# Altium schematic sheet AFE_MCU.SchDoc
size A3; _Date0: 31st Dec 2016; _Designer: Joshua Smith; _Drn0: ABC; _ECN0: N/A; _ISS0: A0; _Notes0: First Issue; _Project: Project; _SchematicNumber: SchematicNumber; _Sheet: 1 of 1; _Title: Title; SheetTitle: **; CompanyName: Microchip Technology Inc.; Organization: Microchip Technology; Address1: 2355 West Chandler Blvd.; Address2: Chandler, AZ  85224; Address4: USA; SheetNumber: 1; SheetTotal: 4; Time: Time
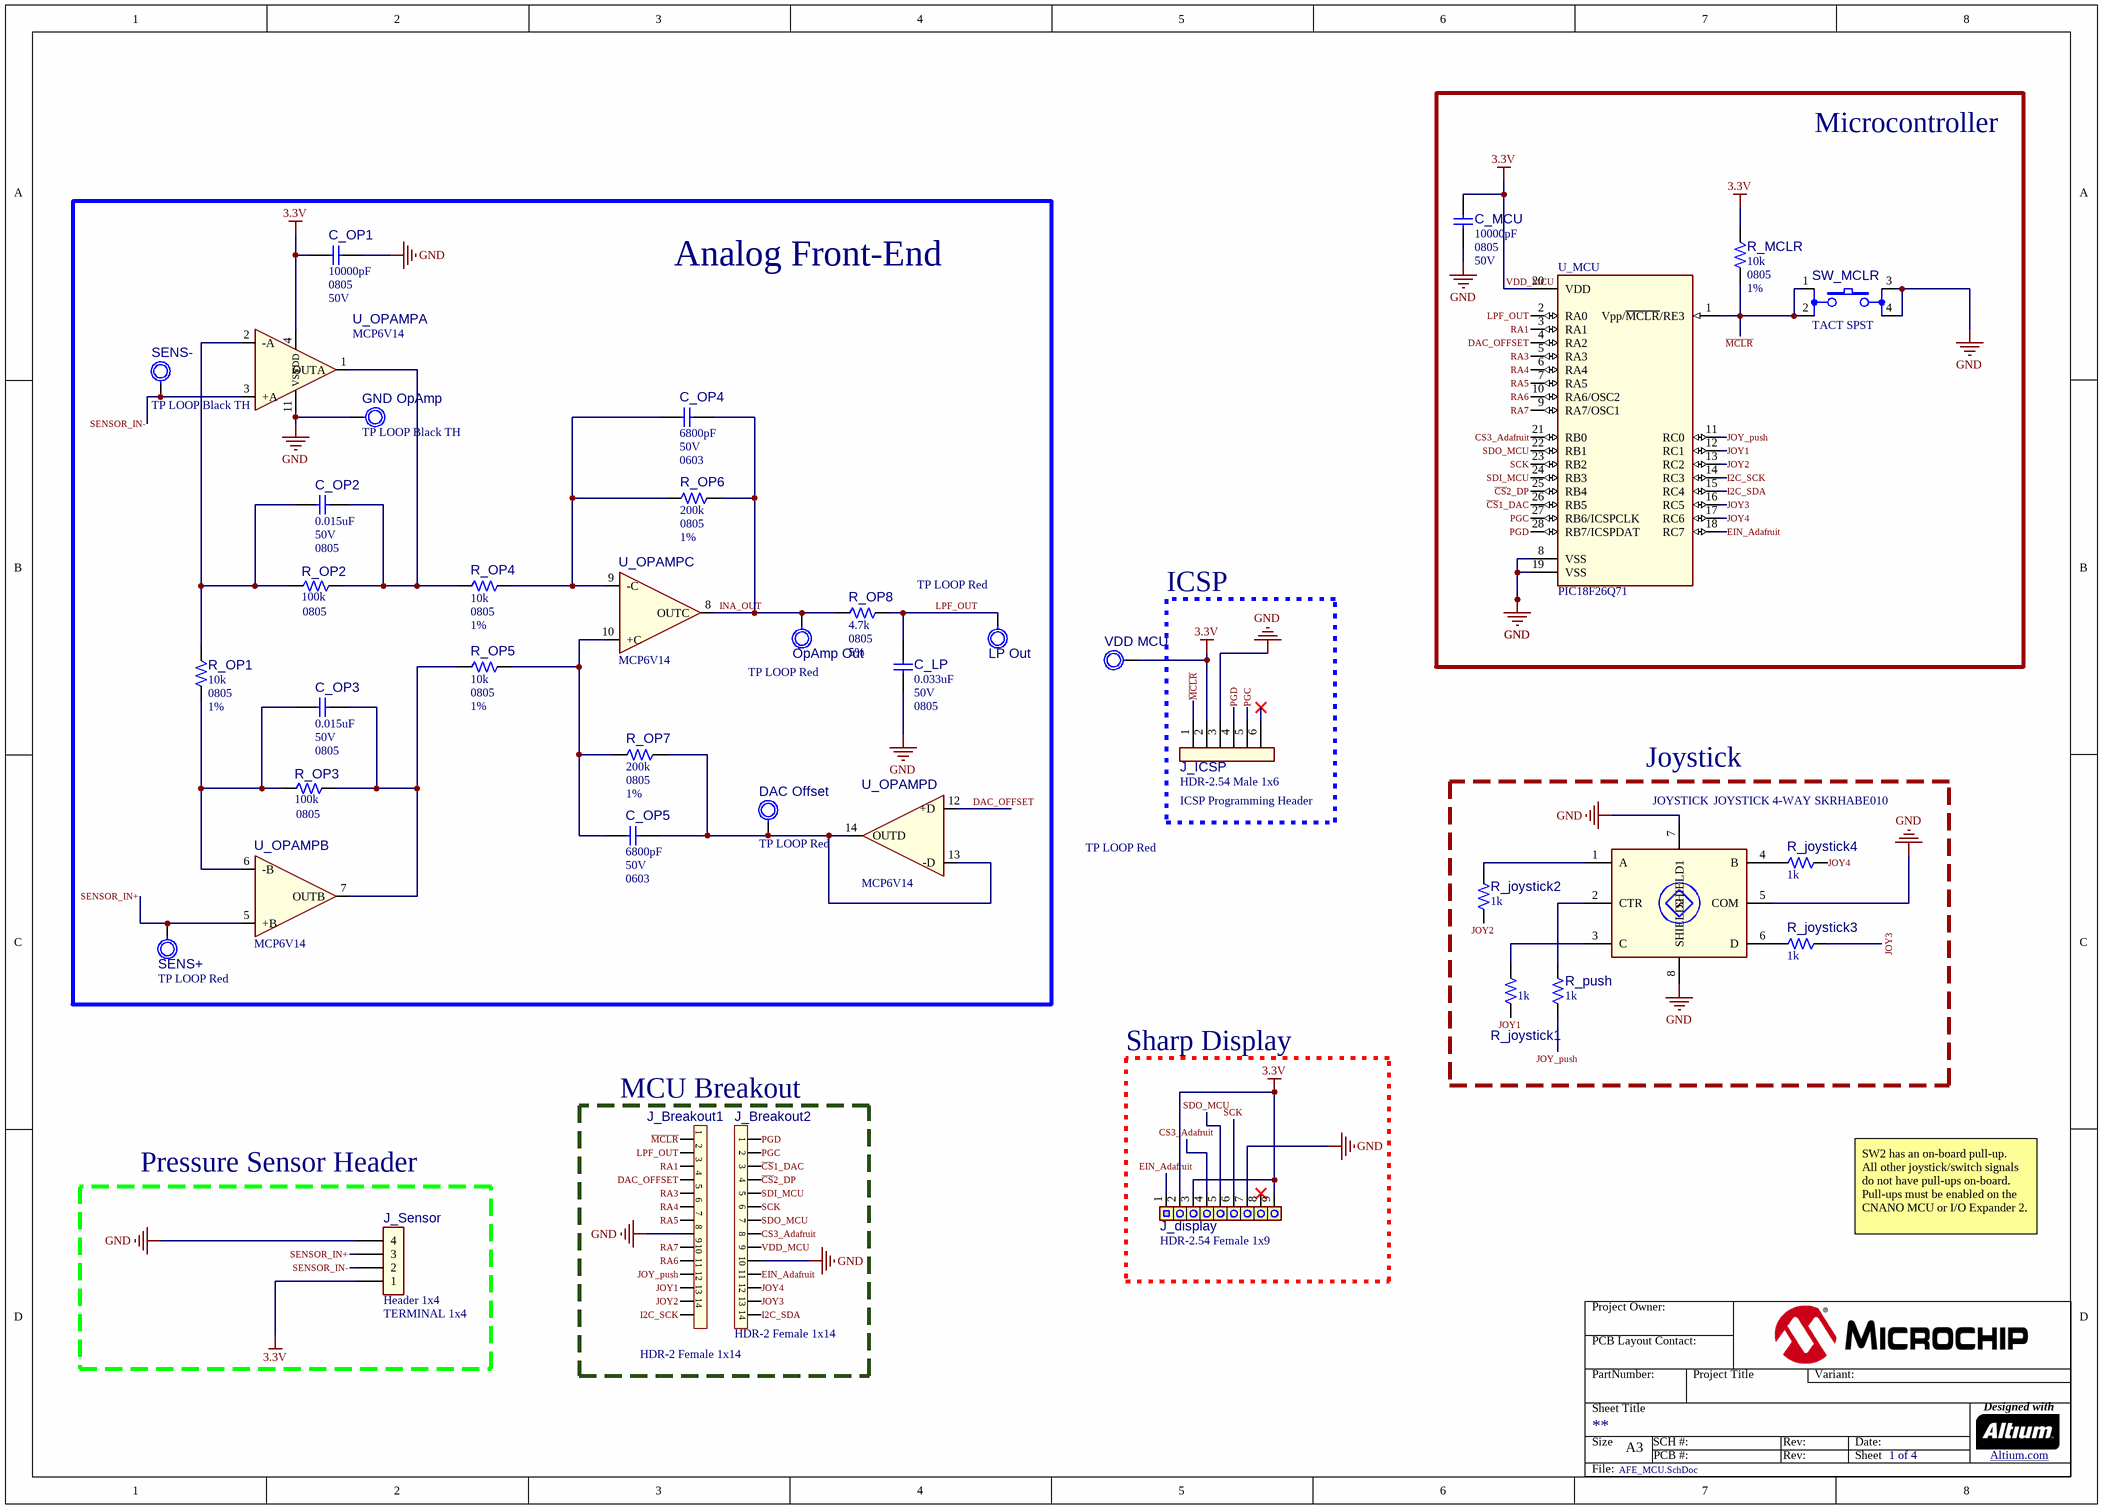
[diagram p0: AFE_MCU.SchDoc]

## Parts
C_LP  value 0.033uF  Voltage: 50V  Package: 0805  [CAP_C_0805]  (hidden comment: Capacitor NP)
C_MCU  value 10000pF  Package: 0805  Voltage: 50V  [CAP_C_0805]  (hidden comment: Capacitor NP)
C_OP1  value 10000pF  Package: 0805  Voltage: 50V  [CAP_C_0805]  (hidden comment: Capacitor NP)
C_OP2  value 0.015uF  Voltage: 50V  Package: 0805  [CAP_C_0805]  (hidden comment: Capacitor NP)
C_OP3  value 0.015uF  Voltage: 50V  Package: 0805  [CAP_C_0805]  (hidden comment: Capacitor NP)
C_OP4  value 6800pF  Voltage: 50V  Package: 0603  [CAP_C_0603]  (hidden comment: Capacitor NP)
C_OP5  value 6800pF  Voltage: 50V  Package: 0603  [CAP_C_0603]  (hidden comment: Capacitor NP)
DAC_Offset  value TP LOOP Red  [CON_TP_TH_V_RED_KEC_5010]  (hidden comment: Test Point)
GND_OpAmp  value TP LOOP Black TH  [CON_TP_TH_V_BLK_KEC_5011]  (hidden comment: Test Point)
J_Breakout1  value HDR-2 Female 1x14  [HDR_F_2_1x14_TH_V]  (hidden comment: Header 1x14)
J_Breakout2  value HDR-2 Female 1x14  [HDR_F_2_1x14_TH_V]  (hidden comment: Header 1x14)
J_display  value HDR-2.54 Female 1x9  [HDR_F_2.54_1x9_TH_V_PPPC091LFBN-RC]  (hidden comment: Header 1x9)
J_ICSP  value HDR-2.54 Male 1x6  [HDR_M_2.54_1x6]  (hidden comment: Header 1x6)
J_Sensor  Header 1x4  value TERMINAL 1x4  [CON_TERMINAL_5.08_1x4_TH_L8.50W20.5H10.20]
JOYSTICK  value JOYSTICK 4-WAY  Manufacturer Part Number 1: SKRHABE010  [SW_TACT_SMD_ALPS_SKRHABE010]  (hidden comment: SW_TACT_SMD_ALPS_SKRHABE010)
LP_Out  value TP LOOP Red  [CON_TP_TH_V_RED_KEC_5010]  (hidden comment: Test Point)
OpAmp_Out  value TP LOOP Red  [CON_TP_TH_V_RED_KEC_5010]  (hidden comment: Test Point)
R_joystick1  value 1k  [RES_C_0805]  (hidden comment: Resistor)
R_joystick2  value 1k  [RES_C_0805]  (hidden comment: Resistor)
R_joystick3  value 1k  [RES_C_0805]  (hidden comment: Resistor)
R_joystick4  value 1k  [RES_C_0805]  (hidden comment: Resistor)
R_MCLR  value 10k  Package: 0805  Tolerance: 1%  [RES_C_0805]  (hidden comment: Resistor)
R_OP1  value 10k  Package: 0805  Tolerance: 1%  [RES_C_0805]  (hidden comment: Resistor)
R_OP2  value 100k  Package: 0805  [RES_C_0805]  (hidden comment: Resistor)
R_OP3  value 100k  Package: 0805  [RES_C_0805]  (hidden comment: Resistor)
R_OP4  value 10k  Package: 0805  Tolerance: 1%  [RES_C_0805]  (hidden comment: Resistor)
R_OP5  value 10k  Package: 0805  Tolerance: 1%  [RES_C_0805]  (hidden comment: Resistor)
R_OP6  value 200k  Package: 0805  Tolerance: 1%  [RES_C_0805]  (hidden comment: Resistor)
R_OP7  value 200k  Package: 0805  Tolerance: 1%  [RES_C_0805]  (hidden comment: Resistor)
R_OP8  value 4.7k  Package: 0805  Tolerance: 5%  [RES_C_0805]  (hidden comment: Resistor)
R_push  value 1k  [RES_C_0805]  (hidden comment: Resistor)
SENS+  value TP LOOP Red  [CON_TP_TH_V_RED_KEC_5010]  (hidden comment: Test Point)
SENS-  value TP LOOP Black TH  [CON_TP_TH_V_BLK_KEC_5011]  (hidden comment: Test Point)
SW_MCLR  value TACT SPST  [SW_SMD_6mmX6mm_TL3301]  (hidden comment: Switch 4 Pin)
U_MCU  value PIC18F26Q71  [SSOP-28_P0.65]  (hidden comment: PIC18F2XK42 SPDIP-28_SOIC-28_SSOP-28)
U_OPAMP  value MCP6V14  [TSSOP-14]  (hidden comment: MCP6XX4_9 SOIC-14_TSSOP-14_PDIP-14)  (parts A,B,C,D of 4)
VDD_MCU  value TP LOOP Red  [CON_TP_TH_V_RED_KEC_5010]  (hidden comment: Test Point)

## Blocks framed on the sheet
Microcontroller: C_MCU R_MCLR SW_MCLR U_MCU
Analog Front-End: C_LP C_OP1-C_OP5 DAC_Offset GND_OpAmp LP_Out OpAmp_Out R_OP1-R_OP8 SENS+ SENS- U_OPAMP
ICSP: J_ICSP
Joystick: JOYSTICK R_joystick1-R_joystick4 R_push
Sharp Display: J_display
MCU Breakout: J_Breakout1 J_Breakout2
Pressure Sensor Header: J_Sensor

## Nets
GND: C_LP.1 C_MCU.2 C_OP1.2 GND_OpAmp.1 J_Breakout1.8 J_Breakout2.10 J_display.7 J_ICSP.3 J_Sensor.4 JOYSTICK.5(COM) JOYSTICK.7(SHIELD1) JOYSTICK.8(SHIELD2) SW_MCLR.3 SW_MCLR.4 U_MCU.8(VSS) U_MCU.19(VSS) U_OPAMP.11(VSS)
VDD_MCU: C_MCU.1 C_OP1.1 J_Breakout2.9 J_display.2 J_display.3 J_display.9 J_ICSP.2 J_Sensor.1 R_MCLR.1 U_MCU.20(VDD) U_OPAMP.4(VDD) VDD_MCU.1  [also labelled 3.3V]
~{CS}1_DAC: J_Breakout2.3 U_MCU.26(RB5)
~{CS}2_DP: J_Breakout2.4 U_MCU.25(RB4)
CS3_Adafruit: J_Breakout2.8 J_display.4 U_MCU.21(RB0)
DAC_OFFSET: J_Breakout1.4 U_MCU.4(RA2) U_OPAMP.12(+D)
EIN_Adafruit: J_Breakout2.11 J_display.1 U_MCU.18(RC7)
I2C_SCK: J_Breakout1.14 U_MCU.14(RC3)
I2C_SDA: J_Breakout2.14 U_MCU.15(RC4)
INA_OUT: C_OP4.2 OpAmp_Out.1 R_OP6.2 R_OP8.1 U_OPAMP.8(OUTC)
JOY1: J_Breakout1.12 R_joystick1.1 U_MCU.12(RC1)
JOY2: J_Breakout1.13 R_joystick2.2 U_MCU.13(RC2)
JOY3: J_Breakout2.13 R_joystick3.1 U_MCU.16(RC5)
JOY4: J_Breakout2.12 R_joystick4.1 U_MCU.17(RC6)
JOY_push: J_Breakout1.11 R_push.1 U_MCU.11(RC0)
LPF_OUT: C_LP.2 J_Breakout1.2 LP_Out.1 R_OP8.2 U_MCU.2(RA0)
~{MCLR}: J_Breakout1.1 J_ICSP.1 R_MCLR.2 SW_MCLR.1 SW_MCLR.2 U_MCU.1(Vpp/~{MCLR}/RE3)
PGC: J_Breakout2.2 J_ICSP.5 U_MCU.27(RB6/ICSPCLK)
PGD: J_Breakout2.1 J_ICSP.4 U_MCU.28(RB7/ICSPDAT)
RA1: J_Breakout1.3 U_MCU.3(RA1)
RA3: J_Breakout1.5 U_MCU.5(RA3)
RA4: J_Breakout1.6 U_MCU.6(RA4)
RA5: J_Breakout1.7 U_MCU.7(RA5)
RA6: J_Breakout1.10 U_MCU.10(RA6/OSC2)
RA7: J_Breakout1.9 U_MCU.9(RA7/OSC1)
SCK: J_Breakout2.6 J_display.6 U_MCU.23(RB2)
SDI_MCU: J_Breakout2.5 U_MCU.24(RB3)
SDO_MCU: J_Breakout2.7 J_display.5 U_MCU.22(RB1)
SENSOR_IN+: J_Sensor.3 SENS+.1 U_OPAMP.5(+B)
SENSOR_IN-: J_Sensor.2 SENS-.1 U_OPAMP.3(+A)
NetC_OP2_1: C_OP2.1 R_OP1.2 R_OP2.1 U_OPAMP.2(-A)
NetC_OP2_2: C_OP2.2 R_OP2.2 R_OP4.2 U_OPAMP.1(OUTA)
NetC_OP3_1: C_OP3.1 R_OP1.1 R_OP3.1 U_OPAMP.6(-B)
NetC_OP3_2: C_OP3.2 R_OP3.2 R_OP5.1 U_OPAMP.7(OUTB)
NetC_OP4_1: C_OP4.1 R_OP4.1 R_OP6.1 U_OPAMP.9(-C)
NetC_OP5_1: C_OP5.1 R_OP5.2 R_OP7.1 U_OPAMP.10(+C)
NetC_OP5_2: C_OP5.2 DAC_Offset.1 R_OP7.2 U_OPAMP.13(-D) U_OPAMP.14(OUTD)
NetJOYSTICK_1: JOYSTICK.1(A) R_joystick2.1
NetJOYSTICK_2: JOYSTICK.2(CTR) R_push.2
NetJOYSTICK_3: JOYSTICK.3(C) R_joystick1.2
NetJOYSTICK_4: JOYSTICK.4(B) R_joystick4.2
NetJOYSTICK_6: JOYSTICK.6(D) R_joystick3.2

Not connected (* = marked no-connect by the designer): J_display 8*; J_ICSP 6*

## Notes on the sheet
- (near J_ICSP) ICSP Programming Header
- SW2 has an on-board pull-up.
  All other joystick/switch signals do not have pull-ups on-board. Pull-ups must be enabled on the CNANO MCU or I/O Expander 2.
- Project Owner:
- PCB Layout Contact:
- PartNumber:
- Project Title
- Variant:
- Sheet Title
- Size
- A3
- SCH #:
- PCB #:
- Rev:
- Date:
- Sheet
- Designed with
- Altium.com <http://go.altium.com/MicrochipLandingPage_Evaluation.html>
- File:

## Library data of the parts
C_LP = CAP2699: Manufacturer 1: TDK Corporation; Manufacturer Part Number 1: C2012C0G1H333J125AA; Description_: CAP CER 0.033uF 50V 5% C0G SMD 0805; Dev Tools Status: Design; Tolerance: 5%; Temperature Coefficient: C0G; Populated: YES; Owner: Florin Paun; Restricted Sourcing: No; MCHP-ID: CAP2699; Revision: 1; Symbol: Capacitor NP; Status: MCL Design; ComponentLink1URL: https://chn-vm-apps.microchip.com/mchprepo/parts/Datasheets/mlcc_commercial_general_en.pdf; ComponentLink1Description: SVN Datasheet; Operating Temperature: -55C to +125C; Type: Ceramic; Category: Capacitor; Quantity Override: 1; Manufacturer 2: TDK Corporation; Manufacturer Part Number 2: C2012C0G1H333J125AE; ComponentLink2URL: C:\ALTIUM_WORK\00001_MCHP-CDB\Datasheets\mlcc_commercial_general_en.pdf; ComponentLink2Description: Local Datasheet; ComponentLink3URL: C:\ALTIUM_WORK\00001_MCHP-CDB\Library\LibraryRefs\Capacitor NP.SchLib; ComponentLink3Description: Open Symbol; ComponentLink4URL: C:\ALTIUM_WORK\00001_MCHP-CDB\Library\Footprints\CAP_C_0805.PcbLib; ComponentLink4Description: Open Footprint; ComponentLink5Description: Open Footprint 2; ComponentLink6Description: Open Footprint 3; ComponentLink7Description: Open Footprint 4; Manufacturer 3: Murata Electronics; Manufacturer Part Number 3: GRM2165C1H333JA01J; Supplier 1: Digi-Key; Supplier Part Number 1: 445-7523-2-ND; Supplier 2: Digi-Key; Supplier Part Number 2: 445-C2012C0G1H333J125AETR-ND; Supplier 3: Digi-Key; Supplier Part Number 3: 490-GRM2165C1H333JA01JTR-ND
C_MCU C_OP1 = CAP0006: Manufacturer Part Number 1: C0805C103K5RACTU; Manufacturer 1: KEMET; Temperature Coefficient: X7R; Description_: CAP CER 10000pF 50V 10% X7R SMD 0805; Populated: YES; Dev Tools Status: Production; Tolerance: 10%; Restricted Sourcing: No; ComponentLink1Description: SVN Datasheet; Revision: 5; Quantity Override: 1; Manufacturer 2: KYOCERA AVX; Status: MCL Design; Manufacturer 4: Yageo; Manufacturer Part Number 4: CC0805KRX7R9BB103; MCHP-ID: CAP0006; Manufacturer 5: Samsung Electro-Mechanics; Manufacturer Part Number 2: 08055C103KAT2A; Manufacturer Part Number 5: CL21B103KBANNNC; Manufacturer 3: Samsung Electro-Mechanics; Manufacturer Part Number 3: CL21B103KBCNNNC; ComponentLink1URL: https://chn-vm-apps.microchip.com/mchprepo/parts/Datasheets/CL_Series_MLCC_ds.pdf; Category: Capacitor; Type: Ceramic; Symbol: Capacitor NP; Operating Temperature: -55C to +125C; ComponentLink2URL: C:\ALTIUM_WORK\00001_MCHP-CDB\Datasheets\CL_Series_MLCC_ds.pdf; ComponentLink2Description: Local Datasheet; ComponentLink3URL: C:\ALTIUM_WORK\00001_MCHP-CDB\Library\LibraryRefs\Capacitor NP.SchLib; ComponentLink3Description: Open Symbol; ComponentLink4URL: C:\ALTIUM_WORK\00001_MCHP-CDB\Library\Footprints\CAP_C_0805.PcbLib; ComponentLink4Description: Open Footprint; ComponentLink5Description: Open Footprint 2; ComponentLink6Description: Open Footprint 3; ComponentLink7Description: Open Footprint 4; Supplier 1: Digi-Key; Supplier Part Number 1: 399-1158-2-ND; Supplier 2: Digi-Key; Supplier Part Number 2: 478-1383-1-ND; Supplier 3: Digi-Key; Supplier Part Number 3: 1276-1078-1-ND; Supplier 4: Digi-Key; Supplier Part Number 4: 311-1136-1-ND; Supplier 5: Samsung Electro-Mechanics; Supplier Part Number 5: CL21B103KBANNNC
C_OP2 C_OP3 = CAP2775: Manufacturer 1: KEMET; Manufacturer Part Number 1: C0805C153J5GACAUTO; Description_: CAP CER 0.015uF 50V 5% C0G SMD 0805 AEC-Q200; Dev Tools Status: Design; Tolerance: 5%; Temperature Coefficient: C0G; Owner: Bianca Nastase; Populated: YES; Restricted Sourcing: No; MCHP-ID: CAP2775; Revision: 1; Symbol: Capacitor NP; Status: MCL Design; ComponentLink1URL: https://chn-vm-apps.microchip.com/mchprepo/parts/Datasheets/KEM_C1022_C0G_AUTO_SMD.pdf; ComponentLink1Description: SVN Datasheet; ComponentLink2URL: C:\ALTIUM_WORK\00001_MCHP-CDB\Datasheets\KEM_C1022_C0G_AUTO_SMD.pdf; ComponentLink2Description: Local Datasheet; ComponentLink3URL: C:\ALTIUM_WORK\00001_MCHP-CDB\Library\LibraryRefs\Capacitor NP.SchLib; ComponentLink3Description: Open Symbol; ComponentLink4URL: C:\ALTIUM_WORK\00001_MCHP-CDB\Library\Footprints\CAP_C_0805.PcbLib; ComponentLink4Description: Open Footprint; ComponentLink5Description: Open Footprint 2; ComponentLink6Description: Open Footprint 3; ComponentLink7Description: Open Footprint 4; Operating Temperature: -55C to +125C; Type: Ceramic; Category: Capacitor; Manufacturer 2: Murata; Manufacturer Part Number 2: GCM2195C1H153JA16D; Manufacturer 3: TDK Corporation; Manufacturer Part Number 3: CGA4F2C0G1H153J085AA; Supplier 1: Mouser; Supplier Part Number 1: 80-C0805C153J5GAUTO; Supplier 2: Mouser; Supplier Part Number 2: 81-GCM2195C1H153JA6D; Supplier 3: Mouser; Supplier Part Number 3: 810-CGA4F2C0G1H153J; Quantity Override: 1
C_OP4 C_OP5 = CAP2237: Manufacturer 1: TDK Corporation; Manufacturer Part Number 1: CGA3E2C0G1H682J080AA; Description_: CAP CER 6.8nF 50V 5% C0G SMD 0603 AEC-Q200; Dev Tools Status: Production; Tolerance: 5%; Temperature Coefficient: C0G; Owner: Steve Dziaba; Populated: YES; Restricted Sourcing: No; MCHP-ID: CAP2237; Revision: 1; Symbol: Capacitor NP; Status: MCL Design; ComponentLink1URL: https://chn-vm-apps.microchip.com/mchprepo/parts/Datasheets/CGA3E2C0G1H682J080AA.pdf; ComponentLink1Description: SVN Datasheet; ComponentLink2URL: C:\ALTIUM_WORK\00001_MCHP-CDB\Datasheets\CGA3E2C0G1H682J080AA.pdf; ComponentLink2Description: Local Datasheet; ComponentLink3URL: C:\ALTIUM_WORK\00001_MCHP-CDB\Library\LibraryRefs\Capacitor NP.SchLib; ComponentLink3Description: Open Symbol; ComponentLink4URL: C:\ALTIUM_WORK\00001_MCHP-CDB\Library\Footprints\CAP_C_0603.PcbLib; ComponentLink4Description: Open Footprint; ComponentLink5Description: Open Footprint 2; ComponentLink6Description: Open Footprint 3; ComponentLink7Description: Open Footprint 4; Operating Temperature: -55C to +125C; Type: Ceramic; Category: Capacitor; Supplier 1: Digi-Key; Supplier Part Number 1: 445-6914-1-ND; Quantity Override: 1; Manufacturer 2: KEMET; Manufacturer Part Number 2: C0603C682J5GACAUTO; Supplier 2: Digi-Key; Supplier Part Number 2: 399-15947-1-ND
DAC_Offset LP_Out OpAmp_Out SENS+ VDD_MCU = CON1084: Manufacturer 1: Keystone; Manufacturer Part Number 1: 5010; Description_: CON TP LOOP Red TH; Dev Tools Status: Production; Owner: Stephen Humberd; Populated: YES; Restricted Sourcing: No; MCHP-ID: CON1084; Revision: D; Symbol: Test Point; Status: MCL Design; ComponentLink1URL: https://chn-vm-apps.microchip.com/mchprepo/parts/Datasheets/5010.pdf; ComponentLink1Description: SVN Datasheet; Type: Test Point; Category: Connector; Quantity Override: 1; ComponentLink2URL: C:\ALTIUM_WORK\00001_MCHP-CDB\Datasheets\5010.pdf; ComponentLink2Description: Local Datasheet; ComponentLink3URL: C:\ALTIUM_WORK\00001_MCHP-CDB\Library\LibraryRefs\Test Point.SchLib; ComponentLink3Description: Open Symbol; ComponentLink4URL: C:\ALTIUM_WORK\00001_MCHP-CDB\Library\Footprints\CON_TP_TH_V_RED_KEC_5010.PcbLib; ComponentLink4Description: Open Footprint; ComponentLink5Description: Open Footprint 2; ComponentLink6Description: Open Footprint 3; ComponentLink7Description: Open Footprint 4; Manufacturer 2: FuZhou XiXiang; Manufacturer Part Number 2: Test Point-1P-DIP-H4.6-Ø2.5-RED; Supplier 1: Digi-Key; Supplier Part Number 1: 36-5010-ND; Supplier 2: FuZhou XiXiang; Supplier Part Number 2: Test Point-1P-DIP-H4.6-Ø2.5-RED; Manufacturer 3: FuZhou XiXiang; Manufacturer Part Number 3: Test Point-1P-DIP-H8.1-Ø3.2-RED; Supplier 3: FuZhou XiXiang; Supplier Part Number 3: Test Point-1P-DIP-H8.1-Ø3.2-RED
GND_OpAmp SENS- = MISC0025: Manufacturer 1: Keystone; Manufacturer Part Number 1: 5011; Description_: CON TP LOOP Black TH; Dev Tools Status: Production; Owner: Tad Ahlvers; Populated: YES; Restricted Sourcing: No; MCHP-ID: MISC0025; Revision: 3; Symbol: Test Point; Status: MCL Design; ComponentLink1URL: https://chn-vm-apps.microchip.com/mchprepo/parts/Datasheets/M60-2p60.pdf; ComponentLink1Description: SVN Datasheet; Type: Test Point; Category: Connector; Quantity Override: 1; ComponentLink2URL: C:\ALTIUM_WORK\00001_MCHP-CDB\Datasheets\M60-2p60.pdf; ComponentLink2Description: Local Datasheet; ComponentLink3URL: C:\ALTIUM_WORK\00001_MCHP-CDB\Library\LibraryRefs\Test Point.SchLib; ComponentLink3Description: Open Symbol; ComponentLink4URL: C:\ALTIUM_WORK\00001_MCHP-CDB\Library\Footprints\CON_TP_TH_V_BLK_KEC_5011.PcbLib; ComponentLink4Description: Open Footprint; ComponentLink5Description: Open Footprint 2; ComponentLink6Description: Open Footprint 3; ComponentLink7Description: Open Footprint 4; Manufacturer 2: FuZhou XiXiang Electronic Technology; Manufacturer Part Number 2: Test Point-1P-DIP-H8.1-Ф3.2-BLACK; Supplier 1: Digi-Key; Supplier Part Number 1: 36-5011-ND; Supplier 2: FuZhou XiXiang Electronic Technology; Supplier Part Number 2: Test Point-1P-DIP-H8.1-Ф3.2-BLACK
J_Breakout1 J_Breakout2 = CON2311: Manufacturer 1: Sullins Connector Solutions; Manufacturer Part Number 1: NPPN141BFCN-RC; Description_: CON HDR-2 Female 1x14 Gold 2.4MH TH; Dev Tools Status: Design; Owner: Octavian Stroe; Populated: YES; Restricted Sourcing: No; MCHP-ID: CON2311; Revision: B; Symbol: Header 1x14; Status: MCL Design; ComponentLink1URL: https://chn-vm-apps.microchip.com/mchprepo/parts/Datasheets/10483.pdf; ComponentLink1Description: SVN Datasheet; ComponentLink2URL: C:\ALTIUM_WORK\00001_MCHP-CDB\Datasheets\10483.pdf; ComponentLink2Description: Local Datasheet; ComponentLink3URL: C:\ALTIUM_WORK\00001_MCHP-CDB\Library\LibraryRefs\Header 1x14.SchLib; ComponentLink3Description: Open Symbol; ComponentLink4URL: C:\ALTIUM_WORK\00001_MCHP-CDB\Library\Footprints\HDR_F_2_1x14_TH_V.PcbLib; ComponentLink4Description: Open Footprint; ComponentLink5Description: Open Footprint 2; ComponentLink6Description: Open Footprint 3; ComponentLink7Description: Open Footprint 4; Type: Header 2mm; Category: Connector; Supplier 1: Digi-Key; Supplier Part Number 1: NPPN141BFCN-RC-ND; Quantity Override: 1; Assembly Type: TH; Operating Temperature: -40C to +105C
J_display = CON2735: Manufacturer 1: Sullins Connector Solutions; Manufacturer Part Number 1: PPPC091LFBN-RC; Description_: CON HDR-2.54 Female 1x9 Gold TH VERT; Dev Tools Status: Design; Owner: Pilar Alcaine; Populated: YES; Restricted Sourcing: No; Voltage: 250V; Current: 3A; MCHP-ID: CON2735; Revision: 1; Symbol: Header 1x9; Status: MCL Design; ComponentLink1URL: https://chn-vm-apps.microchip.com/mchprepo/parts/Datasheets/Female_Headers.100_DS.pdf; ComponentLink1Description: SVN Datasheet; ComponentLink2URL: C:\ALTIUM_WORK\00001_MCHP-CDB\Datasheets\Female_Headers.100_DS.pdf; ComponentLink2Description: Local Datasheet; ComponentLink3URL: C:\ALTIUM_WORK\00001_MCHP-CDB\Library\LibraryRefs\Header 1x9.SchLib; ComponentLink3Description: Open Symbol; ComponentLink4URL: C:\ALTIUM_WORK\00001_MCHP-CDB\Library\Footprints\HDR_F_2.54_1x9_TH_V_PPPC091LFBN-RC.PcbLib; ComponentLink4Description: Open Footprint; ComponentLink5Description: Open Footprint 2; ComponentLink6Description: Open Footprint 3; ComponentLink7Description: Open Footprint 4; Type: Header 2.54mm; Category: Connector; Supplier 1: Digi-Key; Supplier Part Number 1: S7042-ND; Quantity Override: 1; Operating Temperature: -40C to +105C; Assembly Type: TH
J_ICSP = CON1106: Manufacturer 1: FCI; Manufacturer Part Number 1: 68000-106HLF; Description_: CON HDR-2.54 Male 1x6 Gold 5.84MH TH VERT; Dev Tools Status: Production; Populated: Yes; Owner: Bogdan P (M91398); Restricted Sourcing: No; MCHP-ID: CON1106; Revision: 3; Symbol: Header 1x6; Status: MCL Design; ComponentLink1URL: https://chn-vm-apps.microchip.com/mchprepo/parts/Datasheets/68000.pdf; ComponentLink1Description: SVN Datasheet; Type: Header 2.54mm; Category: Connector; Quantity Override: 1; Manufacturer 2: FCI; Manufacturer Part Number 2: 68001-106HLF; Manufacturer 3: Samtec Inc; Manufacturer 4: SHENZHEN JUNHAO ENGINEERING; Manufacturer Part Number 3: TSW-106-07-G-S; Manufacturer Part Number 4: R-211-0611-0021-400; ComponentLink2URL: C:\ALTIUM_WORK\00001_MCHP-CDB\Datasheets\68000.pdf; ComponentLink2Description: Local Datasheet; ComponentLink3URL: C:\ALTIUM_WORK\00001_MCHP-CDB\Library\LibraryRefs\Header 1x6.SchLib; ComponentLink3Description: Open Symbol; ComponentLink4URL: C:\ALTIUM_WORK\00001_MCHP-CDB\Library\Footprints\HDR_M_2.54_1x6.PcbLib; ComponentLink4Description: Open Footprint; ComponentLink5Description: Open Footprint 2; ComponentLink6Description: Open Footprint 3; ComponentLink7Description: Open Footprint 4; Supplier 1: Digi-Key; Supplier Part Number 1: 609-3249-ND; Supplier 2: Digi-Key; Supplier Part Number 2: 609-3272-ND; Supplier 3: Digi-Key; Supplier Part Number 3: SAM1029-06-ND; Supplier 4: SHENZHEN JUNHAO ENGINEERING; Supplier Part Number 4: R-211-0611-0021-400
J_Sensor = CON2391: Manufacturer Part Number 1: EB21A-04-D; Manufacturer 1: Adam Tech; Voltage: 300V; Populated: YES; Owner: Narasimha Murthy; Dev Tools Status: Production; Description_: CON TERMINAL 5.08mm 1x4 Female 16-26AWG 8A TH R/A; Current: 8A; Restricted Sourcing: No; Revision: 1; Type: Terminal Block; MCHP-ID: CON2391; ComponentLink1URL: https://chn-vm-apps.microchip.com/mchprepo/parts/Datasheets/eb21a-04-d-data-sheet.pdf; Symbol: Header 1x4; ComponentLink1Description: SVN Datasheet; Category: Connector; Status: MCL Design; Quantity Override: 1; Operating Temperature: -40C to +105C; ComponentLink2URL: C:\ALTIUM_WORK\00001_MCHP-CDB\Datasheets\eb21a-04-d-data-sheet.pdf; ComponentLink2Description: Local Datasheet; ComponentLink3URL: C:\ALTIUM_WORK\00001_MCHP-CDB\Library\LibraryRefs\Header 1x4.SchLib; ComponentLink3Description: Open Symbol; ComponentLink4URL: C:\ALTIUM_WORK\00001_MCHP-CDB\Library\Footprints\CON_TERMINAL_5.08_1x4_TH_L8.50W20.5H10.20.PcbLib; ComponentLink4Description: Open Footprint; ComponentLink5Description: Open Footprint 2; ComponentLink6Description: Open Footprint 3; ComponentLink7Description: Open Footprint 4; Supplier 1: Digi-Key; Supplier Part Number 1: 2057-EB21A-04-D-ND; Assembly Type: TH
JOYSTICK = SWITCH1202: Manufacturer 1: ALPS ALPINE; Description_: SWITCH JOYSTICK 4-WAY 50mA SKRHABE010 SMD; Populated: YES; Voltage: 12VDC; Current: 50mA; Restricted Sourcing: No; Dev Tools Status: Production; Owner: Jesus Aviles; Revision: 2; Symbol: SW_TACT_SMD_ALPS_SKRHABE010; Category: Switch; Type: Joystick; Supplier 1: Mouser; Supplier Part Number 1: 688-SKRHAB; Operating Temperature: -40C to 85C; MCHP-ID: SWITCH1202; Status: MCL Design; ComponentLink1URL: https://chn-vm-apps.microchip.com/mchprepo/parts/Datasheets/SKRH-1370966.pdf; ComponentLink1Description: SVN Datasheet; ComponentLink2URL: C:\ALTIUM_WORK\00001_MCHP-CDB\Datasheets\SKRH-1370966.pdf; ComponentLink2Description: Local Datasheet; ComponentLink3URL: C:\ALTIUM_WORK\00001_MCHP-CDB\Library\LibraryRefs\SW_TACT_SMD_ALPS_SKRHABE010.SchLib; ComponentLink3Description: Open Symbol; ComponentLink4URL: C:\ALTIUM_WORK\00001_MCHP-CDB\Library\Footprints\SW_TACT_SMD_ALPS_SKRHABE010.PcbLib; ComponentLink4Description: Open Footprint; ComponentLink5Description: Open Footprint 2; ComponentLink6Description: Open Footprint 3; ComponentLink7Description: Open Footprint 4; Quantity Override: 1
R_joystick1-R_joystick4 R_push = RES1221: Manufacturer 1: Vishay; Manufacturer Part Number 1: CRCW08051K00FKEA; Tolerance: 1%; Description_: RES TKF 1k 1% 1/8W SMD 0805; Populated: Yes; Power: 1/8W; Temperature Coefficient: 100ppm/C; Dev Tools Status: Production; Owner: Mihai T (M91442); Voltage: 150V; Package: 0805; Revision: 0; Symbol: Resistor; Category: Resistor; Type: RES SMD; Supplier 1: Digi-Key; Supplier Part Number 1: 541-1.00KCCT-ND; Composition: TKF; Operating Temperature: -55C to +155C; MCHP-ID: RES1221; Status: MCL Design; ComponentLink1Description: SVN Datasheet; ComponentLink2Description: Local Datasheet; ComponentLink3URL: C:\ALTIUM_WORK\00001_MCHP-CDB\Library\LibraryRefs\Resistor.SchLib; ComponentLink3Description: Open Symbol; ComponentLink4URL: C:\ALTIUM_WORK\00001_MCHP-CDB\Library\Footprints\RES_C_0805.PcbLib; ComponentLink4Description: Open Footprint; ComponentLink5Description: Open Footprint 2; ComponentLink6Description: Open Footprint 3; ComponentLink7Description: Open Footprint 4; Quantity Override: 1; ComponentLink1URL: https://chn-vm-apps.microchip.com/mchprepo/parts/Datasheets/dcrcwe3.pdf; ComponentLink2URL: C:\ALTIUM_WORK\00001_MCHP-CDB\Datasheets\dcrcwe3.pdf; Supplier 2: Farnell; Supplier Part Number 2: 1469847RL
R_MCLR R_OP1 R_OP4 R_OP5 = RES2297: Manufacturer 1: TE Connectivity; Manufacturer Part Number 1: CRGH0805F10K; Description_: RES TKF 10K 1% 1/3W SMD 0805; Dev Tools Status: Production; Power: 1/3W; Owner: Mark Loper; Populated: YES; Restricted Sourcing: No; MCHP-ID: RES2297; Revision: 3; Symbol: Resistor; Status: MCL Design; ComponentLink1URL: https://chn-vm-apps.microchip.com/mchprepo/parts/Datasheets/CRGH_Series_Resistors.pdf; ComponentLink1Description: SVN Datasheet; ComponentLink2URL: C:\ALTIUM_WORK\00001_MCHP-CDB\Datasheets\CRGH_Series_Resistors.pdf; ComponentLink2Description: Local Datasheet; ComponentLink3URL: C:\ALTIUM_WORK\00001_MCHP-CDB\Library\LibraryRefs\Resistor.SchLib; ComponentLink3Description: Open Symbol; ComponentLink4URL: C:\ALTIUM_WORK\00001_MCHP-CDB\Library\Footprints\RES_C_0805.PcbLib; ComponentLink4Description: Open Footprint; ComponentLink5Description: Open Footprint 2; ComponentLink6Description: Open Footprint 3; ComponentLink7Description: Open Footprint 4; Category: Resistor; Type: RES SMD; Composition: TKF; Supplier 1: Digi-Key; Supplier Part Number 1: A126417CT-ND; Quantity Override: 1
R_OP2 R_OP3 = RSMT0025: Manufacturer 1: Panasonic; Manufacturer Part Number 1: ERJ-6GEYJ104V; Tolerance: 5%; Power: 1/8W; Description_: RES TKF 100k 5% 1/8W SMD 0805; Dev Tools Status: Production; Voltage: 150V; Temperature Coefficient: 100ppm/C; Populated: Yes; MCHP-ID: RSMT0025; Revision: 2; Symbol: Resistor; Status: MCL Design; ComponentLink1URL: https://chn-vm-apps.microchip.com/mchprepo/parts/Datasheets/PYu-RC0805_51_RoHS_L_4.pdf; ComponentLink1Description: SVN Datasheet; ComponentLink2URL: C:\ALTIUM_WORK\00001_MCHP-CDB\Datasheets\PYu-RC0805_51_RoHS_L_4.pdf; ComponentLink2Description: Local Datasheet; ComponentLink3URL: C:\ALTIUM_WORK\00001_MCHP-CDB\Library\LibraryRefs\Resistor.SchLib; ComponentLink3Description: Open Symbol; ComponentLink4URL: C:\ALTIUM_WORK\00001_MCHP-CDB\Library\Footprints\RES_C_0805.PcbLib; ComponentLink4Description: Open Footprint; ComponentLink5Description: Open Footprint 2; ComponentLink6Description: Open Footprint 3; ComponentLink7Description: Open Footprint 4; Operating Temperature: -55C to +155C; Category: Resistor; Type: RES SMD; Composition: TKF; Manufacturer 2: Stackpole Electronics Inc; Manufacturer Part Number 2: RMCF0805JT100K; Manufacturer 3: Yageo; Manufacturer Part Number 3: RC0805JR-07100KL; Supplier 1: Digi-Key; Supplier Part Number 1: P100KACT-ND; Supplier 2: Digi-Key; Supplier Part Number 2: P100KATR-ND; Supplier 3: Digi-Key; Supplier Part Number 3: RMCF0805JT100KTR-ND; Supplier 4: Digi-Key; Supplier Part Number 4: 311-100KARTR-ND; Quantity Override: 1
R_OP6 R_OP7 = RES2850: Manufacturer 1: Panasonic Electronic Components; Manufacturer Part Number 1: ERJ-6ENF2003V; Description_: RES TF 200k 1% 1/8W SMD 0805; Dev Tools Status: Design; Power: 1/8W; Owner: Florin Paun; Populated: YES; Voltage: 150V; Temperature Coefficient: 100ppm/C; Restricted Sourcing: No; MCHP-ID: RES2850; Revision: 3; Symbol: Resistor; Status: MCL Design; ComponentLink1URL: https://chn-vm-apps.microchip.com/mchprepo/parts/Datasheets/AOA0000C304.pdf; ComponentLink1Description: SVN Datasheet; Operating Temperature: -55C to +155C; Category: Resistor; Type: RES SMD; Composition: TF; Quantity Override: 1; ComponentLink2URL: C:\ALTIUM_WORK\00001_MCHP-CDB\Datasheets\AOA0000C304.pdf; ComponentLink2Description: Local Datasheet; ComponentLink3URL: C:\ALTIUM_WORK\00001_MCHP-CDB\Library\LibraryRefs\Resistor.SchLib; ComponentLink3Description: Open Symbol; ComponentLink4URL: C:\ALTIUM_WORK\00001_MCHP-CDB\Library\Footprints\RES_C_0805.PcbLib; ComponentLink4Description: Open Footprint; ComponentLink5Description: Open Footprint 2; ComponentLink6Description: Open Footprint 3; ComponentLink7Description: Open Footprint 4; Manufacturer 2: Stackpole Electronics Inc; Manufacturer Part Number 2: RMCF0805FT200K; Manufacturer 3: Bourns; Manufacturer Part Number 3: CR0805-FX-2003ELF; Manufacturer 4: Panasonic; Manufacturer Part Number 4: ERJ-U06F2003V; Manufacturer 5: Vishay; Manufacturer Part Number 5: RCA0805200KFKEA; Supplier 1: Digi-Key; Supplier Part Number 1: P200KCTR-ND; Supplier 2: Digi-Key; Supplier Part Number 2: RMCF0805FT200KTR-ND; Supplier 3: Mouser; Supplier Part Number 3: 652-CR0805FX-2003ELF; Supplier 4: Mouser; Supplier Part Number 4: 667-ERJ-U06F2003V; Supplier 5: Mouser; Supplier Part Number 5: 71-RCA0805200KFKEA
R_OP8 = RSMT0091: Manufacturer 1: Panasonic; Manufacturer Part Number 1: ERJ-6GEYJ472V; Description_: RES TKF 4.7k 5% 1/8W SMD 0805; Dev Tools Status: Production; Voltage: 150V; Temperature Coefficient: 100ppm/C; Power: 1/8W; Populated: Yes; MCHP-ID: RSMT0091; Revision: 2; Symbol: Resistor; Status: MCL Design; ComponentLink1URL: https://chn-vm-apps.microchip.com/mchprepo/parts/Datasheets/PYu-RC0805_51_RoHS_L_4.pdf; ComponentLink1Description: SVN Datasheet; Operating Temperature: -55C to +155C; Category: Resistor; Type: RES SMD; Composition: TKF; Quantity Override: 1; Manufacturer 2: ROHM; Manufacturer 3: Yageo; Manufacturer Part Number 2: MCR10EZHJ472; Manufacturer Part Number 3: RC0805JR-074K7L; ComponentLink2URL: C:\ALTIUM_WORK\00001_MCHP-CDB\Datasheets\PYu-RC0805_51_RoHS_L_4.pdf; ComponentLink2Description: Local Datasheet; ComponentLink3URL: C:\ALTIUM_WORK\00001_MCHP-CDB\Library\LibraryRefs\Resistor.SchLib; ComponentLink3Description: Open Symbol; ComponentLink4URL: C:\ALTIUM_WORK\00001_MCHP-CDB\Library\Footprints\RES_C_0805.PcbLib; ComponentLink4Description: Open Footprint; ComponentLink5Description: Open Footprint 2; ComponentLink6Description: Open Footprint 3; ComponentLink7Description: Open Footprint 4; Manufacturer 4: Yageo; Manufacturer Part Number 4: 9C08052A4701JLHFT; Manufacturer 5: KOA Speer; Manufacturer Part Number 5: RK73B2ATTD472J; Manufacturer 6: Yageo; Manufacturer Part Number 6: 9C08052A4701JLPFT; Supplier 1: Digi-Key; Supplier Part Number 1: P4.7KATR-ND; Supplier 2: Digi-Key; Supplier Part Number 2: P4.7KACT-ND; Supplier 3: Digi-Key; Supplier Part Number 3: RHM4.7KACT-ND; Supplier 4: Digi-Key; Supplier Part Number 4: 311-4.7KARTR-ND; Supplier 5: Digi-Key; Supplier Part Number 5: 311-4.7KACT-ND; Supplier 6: KOA Speer; Supplier Part Number 6: RK73B2ATTD472J; Supplier 7: Yageo; Supplier Part Number 7: 9C08052A4701JLPFT
SW_MCLR = SWITCH0003: Switch; Manufacturer 1: E-Switch; Manufacturer Part Number 1: TL3301NF260QG/TR; Description_: SWITCH TACT SPST 12V 50mA TL3301NF160QG/TR SMD; Dev Tools Status: Production; Voltage: 12V; Current: 50mA; Populated: Yes; MCHP-ID: SWITCH0003; Revision: 4; Symbol: Switch 4 Pin; Status: MCL Design; ComponentLink1URL: https://chn-vm-apps.microchip.com/mchprepo/parts/Datasheets/TL3301.pdf; ComponentLink1Description: SVN Datasheet; Operating Temperature: -20C to +70C; Category: Switch; Type: Tactile; Manufacturer 2: E-Switch; Manufacturer Part Number 2: TL3301NF260QG; Manufacturer 3: E-Switch; Manufacturer Part Number 3: TL3301NF160QG/TR; Manufacturer 4: OMRON; Manufacturer Part Number 4: B3S-1002P; Manufacturer 5: OMRON; Manufacturer Part Number 5: B3S-1000P; Manufacturer 6: OMRON; Manufacturer Part Number 6: B3S-1000; Manufacturer 7: OMRON; Manufacturer Part Number 7: B3S-1002; Manufacturer 8: Switech Electronics Co. Ltd; Manufacturer Part Number 8: TS2A-043C(R)-G9-H; Quantity Override: 1; ComponentLink2Description: Local Datasheet; ComponentLink2URL: C:\ALTIUM_WORK\00001_MCHP-CDB\Datasheets\TL3301.pdf; ComponentLink3Description: Open Symbol; ComponentLink3URL: C:\ALTIUM_WORK\00001_MCHP-CDB\Library\LibraryRefs\Switch 4 Pin.SchLib; ComponentLink4Description: Open Footprint; ComponentLink4URL: C:\ALTIUM_WORK\00001_MCHP-CDB\Library\Footprints\SW_SMD_6mmX6mm_TL3301.PcbLib; ComponentLink5Description: Open Footprint 2; ComponentLink6Description: Open Footprint 3; ComponentLink7Description: Open Footprint 4; Supplier 1: Digi-Key; Supplier 2: Digi-Key; Supplier 3: Digi-Key; Supplier 4: Digi-Key; Supplier 5: Digi-Key; Supplier 6: Digi-Key; Supplier 7: Digi-Key; Supplier 8: Switech Electronics Co. Ltd; Supplier Part Number 1: EG1868CT-ND; Supplier Part Number 2: EG1868TR-ND; Supplier Part Number 3: EG1867CT-ND; Supplier Part Number 4: SW837CT-ND; Supplier Part Number 5: SW836CT-ND; Supplier Part Number 6: SW415-ND; Supplier Part Number 7: SW416-ND; Supplier Part Number 8: TS2A-043C(R)-G9-H
U_MCU = MIC9964: Manufacturer 1: Microchip Technology; Manufacturer Part Number 1: PIC18F26Q71-I/SS; Description_: MCHP MCU 8-BIT 64MHz 64kB 4kB PIC18F26Q71-I/SS SSOP-28; Dev Tools Status: Production; Owner: Are Halvorsen; Populated: YES; Restricted Sourcing: No; MCHP-ID: MIC9964; Symbol: PIC18F2XK42 SPDIP-28_SOIC-28_SSOP-28; Type: 8-Bit; Status: MCL Design; Revision: 1; Category: MCHP-Microcontroller; ComponentLink1URL: https://www.microchip.com/sitesearch/search/Product%20and%20Development%20Tools/PIC18F26Q71-I/SS; ComponentLink1Description: SVN Datasheet; ComponentLink2Description: Local Datasheet; ComponentLink3URL: C:\ALTIUM_WORK\00001_MCHP-CDB\Library\LibraryRefs\PIC18F2XK42 SPDIP-28_SOIC-28_SSOP-28.SchLib; ComponentLink3Description: Open Symbol; ComponentLink4URL: C:\ALTIUM_WORK\00001_MCHP-CDB\Library\Footprints\SSOP-28_P0.65.PcbLib; ComponentLink4Description: Open Footprint; ComponentLink5Description: Open Footprint 2; ComponentLink6Description: Open Footprint 3; ComponentLink7Description: Open Footprint 4; Manufacturer 2: Microchip Technology; Manufacturer Part Number 2: PIC18F26Q71T-I/SS; Supplier 1: Microchip Technology; Supplier Part Number 1: PIC18F26Q71-I/SS; Supplier 2: Microchip Technology; Supplier Part Number 2: PIC18F26Q71T-I/SS; Operating Temperature: -40C to +85C; Quantity Override: 1
U_OPAMP = MIC9608: OPAMP; Manufacturer 1: Microchip Technology; Manufacturer Part Number 1: MCP6V14-E/ST; Description_: MCHP ANALOG OPAMP 4-Ch 80kHz MCP6V14-E/ST TSSOP-14; Dev Tools Status: Design; Owner: Alexandru Chiser; Populated: YES; Restricted Sourcing: No; MCHP-ID: MIC9608; Symbol: MCP6XX4_9 SOIC-14_TSSOP-14_PDIP-14; Type: OpAmp; Status: MCL Design; Revision: 1; Category: MCHP-Analog; ComponentLink1URL: https://chn-vm-apps.microchip.com/mchprepo/parts/Datasheets/20005124B.pdf; ComponentLink1Description: SVN Datasheet; ComponentLink2URL: C:\ALTIUM_WORK\00001_MCHP-CDB\Datasheets\20005124B.pdf; ComponentLink2Description: Local Datasheet; ComponentLink3URL: C:\ALTIUM_WORK\00001_MCHP-CDB\Library\LibraryRefs\MCP6XX4_9 SOIC-14_TSSOP-14_PDIP-14.SchLib; ComponentLink3Description: Open Symbol; ComponentLink4URL: C:\ALTIUM_WORK\00001_MCHP-CDB\Library\Footprints\TSSOP-14.PcbLib; ComponentLink4Description: Open Footprint; ComponentLink5Description: Open Footprint 2; ComponentLink6Description: Open Footprint 3; ComponentLink7Description: Open Footprint 4; Supplier 1: Microchip Technology; Supplier Part Number 1: MCP6V14-E/ST; Operating Temperature: -40C to +125C; Quantity Override: 1